# Altium schematic sheet TELM0003_TempSense.SchDoc: Temperature Sensor Circuit
size A3; Engineer: A. SHAW; Organization: BLUEsat Project; Address1: Room 419; Address2: School of EE&T; Address3: UNSW, NSW 2052; Address4: Australia; DocumentNumber: TELM0003; SheetNumber: 1; SheetTotal: 1; Version: 1.0
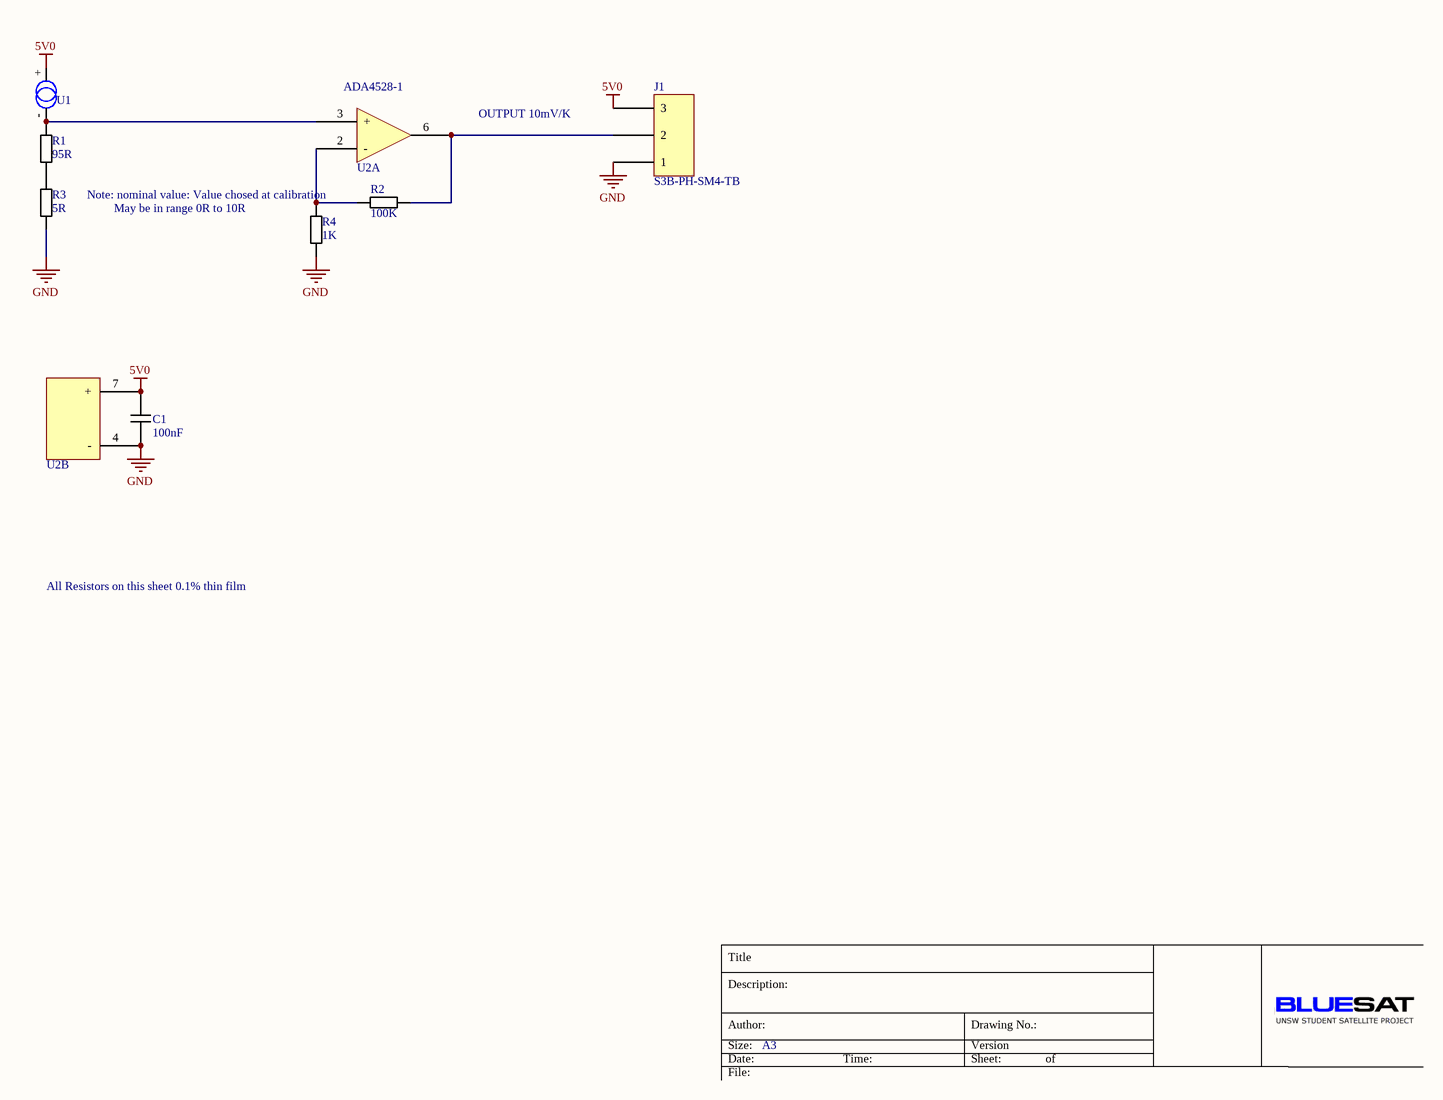
[diagram p0: TELM0003_TempSense.SchDoc]

## Parts
C1  value 100nF  [1206 Cap]  (hidden comment: 1206 Cap)
J1  S3B-PH-SM4-TB  [S3B-PH-SM4-TB]
R1  value 95R  [0603 Resistor]  (hidden comment: 0603 Resistor)
R2  value 100K  [0603 Resistor]  (hidden comment: 0603 Resistor)
R3  value 5R  [0603 Resistor]  (hidden comment: 0603 Resistor)
R4  value 1K  [0603 Resistor]  (hidden comment: 0603 Resistor)
U1  AD590KF  [5.05mm Terminal Block - 2]  (value not drawn)
U2  ADA4528-1  [SOIC8 - LME49720]  (parts A,B of 2)

## Nets
5V0: C1.2 J1.3 U1.+ U2.7(+)
GND: C1.1 J1.1 R3.1 R4.1 U2.4(-)
NetJ1_2: J1.2 R2.1 U2.6(Out)
NetR1_1: R1.1 R3.2
NetR1_2: R1.2 U1.- U2.3(+)
NetR2_2: R2.2 R4.2 U2.2(-)

## Notes on the sheet
- OUTPUT 10mV/K
- (near R2) Note: nominal value: Value chosed at calibration
- May be in range 0R to 10R
- All Resistors on this sheet 0.1% thin film
- Title
- Description:
- Size:
- Author:
- Date:
- A3
- Time:
- Version
- Sheet:
- Drawing No.:
- of
- File:

## Library data of the parts
C1 = 1206 MLCC - X7R, 10%
J1 = S3B-PH-SM4-TB: JST connector
R1-R4 = 0603 Thin Film Resistor 0.1%
U1 = AD590KF: Temperature sensor IC; pin to pad: +>1 ->2
U2 = ADA4528-1: Dual, High Performance Audio Operational Amplifier; ComponentLink1Description: Datasheet; ComponentLink1URL: http://www.national.com/ds/LM/LME49720.pdf